# EAGLE schematic back (EAGLE 7.7.0)
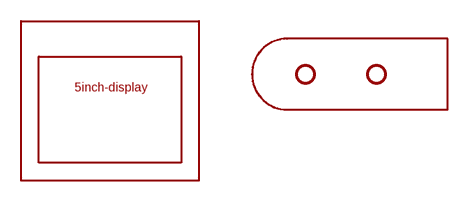
[diagram p0: schematic, sheet 1]

## Parts
U$1  5INCH-DISPLAY-GUIDE  [5INCH-DISP]
U$2  L-PARTS  [L-PARTS]

## Library data of the parts
U$1 = 0-chirimen:5INCH-DISPLAY-GUIDE
U$2 = 0-chirimen:L-PARTS